# Altium project PCB_Project.PrjPcb
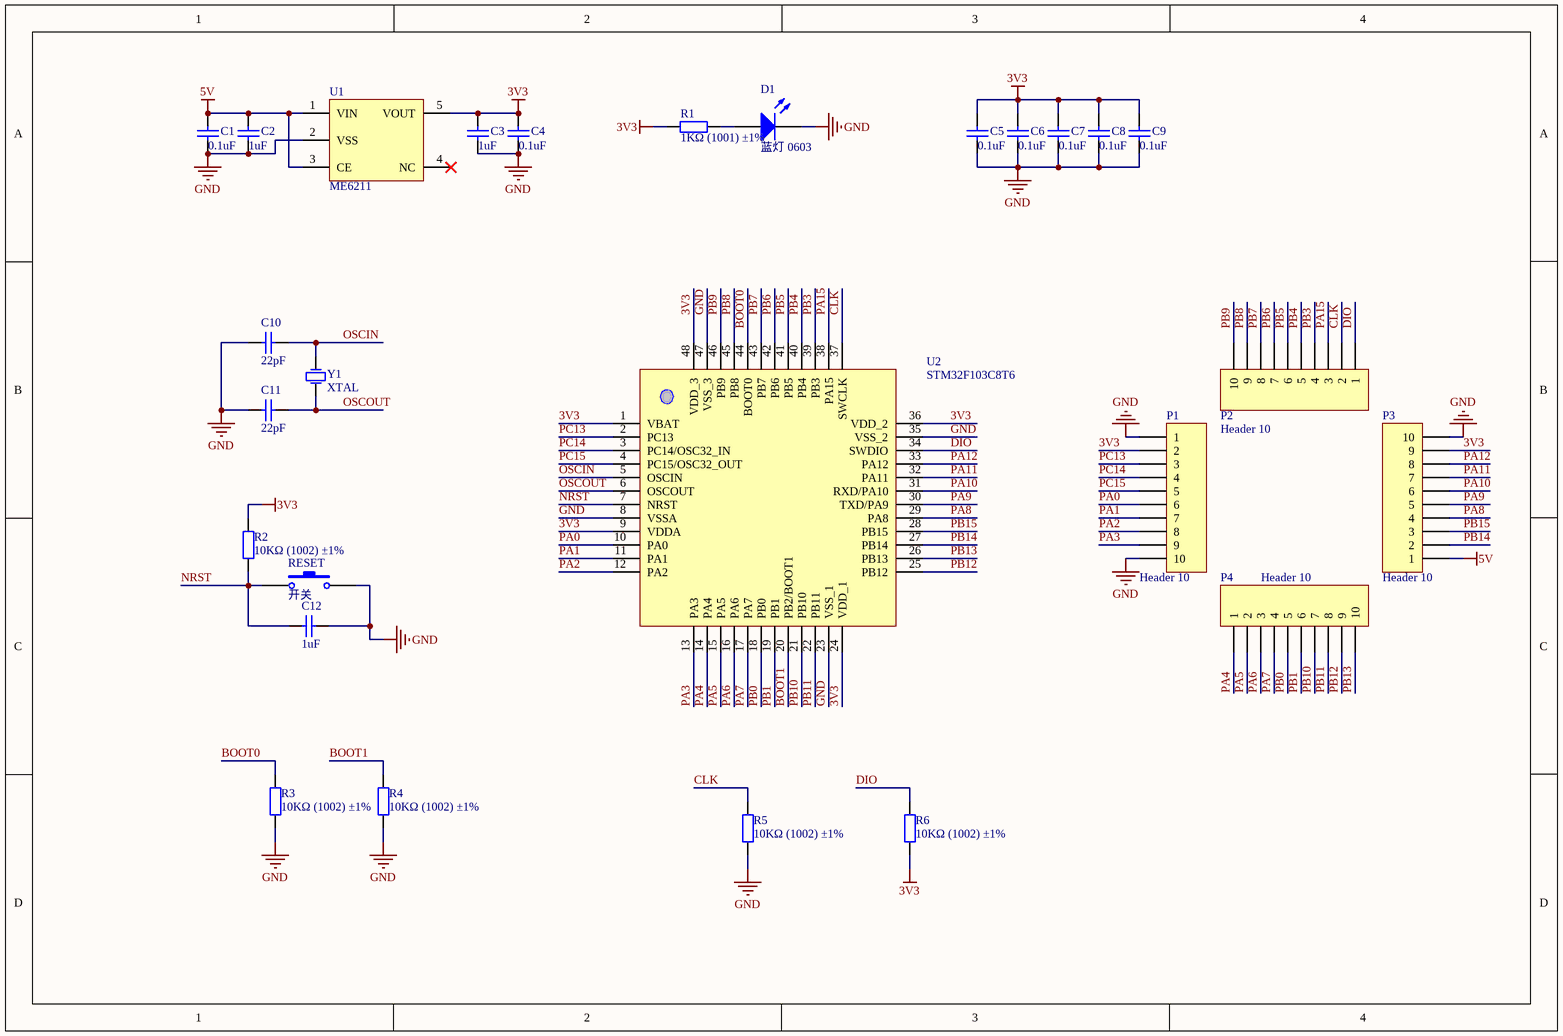
[diagram p0: 原理图.SchDoc]
1 sheet, 27 parts. Net scope: global (net labels, ports and power ports of the same name join across sheets).
Board file: PCB1.PcbDoc

## Sheet 原理图.SchDoc
size A4

### Parts
C1  value 0.1uF  [0603_C]  (hidden comment: Cap)
C2  value 1uF  [0603_C]  (hidden comment: Cap)
C3  value 1uF  [0603_C]  (hidden comment: Cap)
C4  value 0.1uF  [0603_C]  (hidden comment: Cap)
C5  value 0.1uF  [0603_C]  (hidden comment: Cap)
C6  value 0.1uF  [0603_C]  (hidden comment: Cap)
C7  value 0.1uF  [0603_C]  (hidden comment: Cap)
C8  value 0.1uF  [0603_C]  (hidden comment: Cap)
C9  value 0.1uF  [0603_C]  (hidden comment: Cap)
C10  22pF  [0603_C]
C11  22pF  [0603_C]
C12  value 1uF  [0603_C]  (hidden comment: Cap)
D1  蓝灯 0603  [0603_LED_S1]
P1  Header 10  [MH10]
P2  Header 10  [MH10]
P3  Header 10  [MH10]
P4  Header 10  [MH10]
R1  1KΩ (1001) ±1%  [0603_R]
R2  10KΩ (1002) ±1%  [0603_R]
R3  10KΩ (1002) ±1%  [0603_R]
R4  10KΩ (1002) ±1%  [0603_R]
R5  10KΩ (1002) ±1%  [0603_R]
R6  10KΩ (1002) ±1%  [0603_R]
RESET  开关  [KEY-K2]
U1  ME6211  [SOT23-5]
U2  STM32F103C8T6  [LQFP-48_7x7x05P]
Y1  XTAL  [XTAL_5032]

### Nets
3V3: C3.2 C4.2 C5.2 C6.2 C7.2 C8.2 C9.2 P1.2 P3.9 R1.1 R2.2 R6.1 U1.5(VOUT) U2.1(VBAT) U2.9(VDDA) U2.24(VDD_1) U2.36(VDD_2) U2.48(VDD_3)
5V: C1.2 C2.2 P3.1 U1.1(VIN) U1.3(CE)
GND: C1.1 C2.1 C3.1 C4.1 C5.1 C6.1 C7.1 C8.1 C9.1 C10.1 C11.1 C12.2 D1.K P1.1 P1.10 P3.10 R3.1 R4.1 R5.1 RESET.2 U1.2(VSS) U2.8(VSSA) U2.23(VSS_1) U2.35(VSS_2) U2.47(VSS_3)
BOOT0: R3.2 U2.44(BOOT0)
BOOT1: R4.2 U2.20(PB2/BOOT1)
CLK: P2.2 R5.2 U2.37(SWCLK)
DIO: P2.1 R6.2 U2.34(SWDIO)
NRST: C12.1 R2.1 RESET.1 U2.7(NRST)
OSCIN: C10.2 U2.5(OSCIN) Y1.2(OSC2)
OSCOUT: C11.2 U2.6(OSCOUT) Y1.1(OSC1)
PA0: P1.6 U2.10(PA0)
PA1: P1.7 U2.11(PA1)
PA2: P1.8 U2.12(PA2)
PA3: P1.9 U2.13(PA3)
PA4: P4.1 U2.14(PA4)
PA5: P4.2 U2.15(PA5)
PA6: P4.3 U2.16(PA6)
PA7: P4.4 U2.17(PA7)
PA8: P3.4 U2.29(PA8)
PA9: P3.5 U2.30(TXD/PA9)
PA10: P3.6 U2.31(RXD/PA10)
PA11: P3.7 U2.32(PA11)
PA12: P3.8 U2.33(PA12)
PA15: P2.3 U2.38(PA15)
PB0: P4.5 U2.18(PB0)
PB1: P4.6 U2.19(PB1)
PB3: P2.4 U2.39(PB3)
PB4: P2.5 U2.40(PB4)
PB5: P2.6 U2.41(PB5)
PB6: P2.7 U2.42(PB6)
PB7: P2.8 U2.43(PB7)
PB8: P2.9 U2.45(PB8)
PB9: P2.10 U2.46(PB9)
PB10: P4.7 U2.21(PB10)
PB11: P4.8 U2.22(PB11)
PB12: P4.9 U2.25(PB12)
PB13: P4.10 U2.26(PB13)
PB14: P3.2 U2.27(PB14)
PB15: P3.3 U2.28(PB15)
PC13: P1.3 U2.2(PC13)
PC14: P1.4 U2.3(PC14/OSC32_IN)
PC15: P1.5 U2.4(PC15/OSC32_OUT)
NetD1_A: D1.A R1.2

Not connected (* = marked no-connect by the designer): U1 4(NC)*

### Library data of the parts
C1-C9 C12 = 0603 1uF (105) 10% 50V: 贴片电容; ComponentLink1Description: 供应商链接; ComponentLink1URL: http://www.szlcsc.com/product/details_16531.html; Package: 0603; Supplier: LC; SuppliersPartNumber: C15849
C10 C11 = 0603 20pF (200) 5% 50V: 贴片电容; ComponentLink1Description: 供应商链接; ComponentLink1URL: http://www.szlcsc.com/product/details_2000.html; Package: 0603; Supplier: LC; SuppliersPartNumber: C1648
D1 = 0603 蓝灯: 发光二极管; ComponentLink1Description: 供应商链接; ComponentLink1URL: http://www.szlcsc.com/product/details_73150.html; Package: 0603; Supplier: LC; SuppliersPartNumber: C72041
P1-P4 = Header 10: Header, 10-Pin; LatestRevisionDate: 17-Jul-2002; LatestRevisionNote: Re-released for DXP Platform.; Publisher: Altium Limited
R1 = 0603 1KΩ (1001) 1%: 贴片电阻; ComponentLink1Description: 供应商链接; ComponentLink1URL: http://www.szlcsc.com/product/details_21904.html; Package: 0603; Supplier: LC; SuppliersPartNumber: C21190
R2-R6 = 0603 10KΩ (1002) 1%: 贴片电阻; ComponentLink1Description: 供应商链接; ComponentLink1URL: http://www.szlcsc.com/product/details_26547.html; Package: 0603; Supplier: LC; SuppliersPartNumber: C25804
RESET = 轻触开关
U2 = STM32F103C8T6: STM32单片机48引脚
Y1 = XTAL: Crystal Oscillator; Published: 8-Jun-2000; LatestRevisionDate: 17-Jul-2002; LatestRevisionNote: Re-released for DXP Platform.; PackageReference: R38; Publisher: Altium Limited